# EAGLE schematic peripherial_schematic (EAGLE 9.3.0)
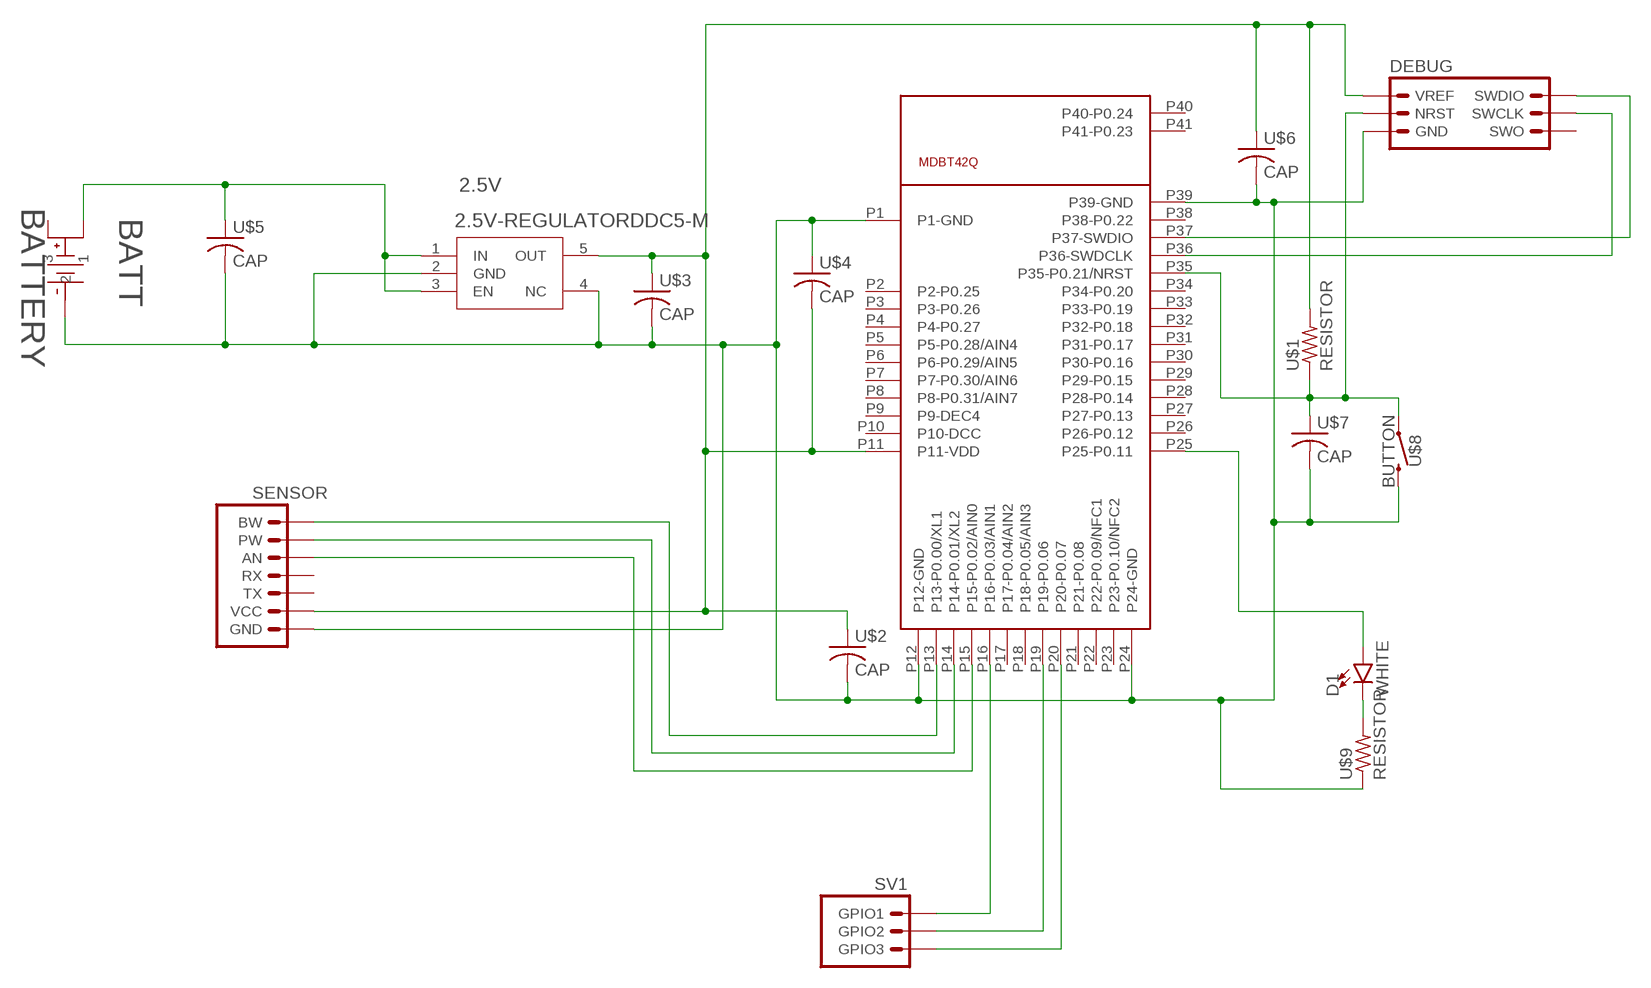
[diagram p0: schematic, sheet 1]

## Parts
2.5V  2.5V-REGULATORDDC5-M  [DDC5-M]
BATT  BATTERY  [BAT_HLDR_2468]
D1  WHITE  LED_12061206  [LED-1206]
DEBUG  DEBUGGER  [MA03-2]
MICRO  MDBT42Q  [MDBT40]
SENSOR  SENSORHEADER  [MA07-1]
SV1  GPIO  [MA03-1]
U$1  RESISTOR  [M1206]
U$2  CAP  [C1206]
U$3  CAP  [C1206]
U$4  CAP  [C1206]
U$5  CAP  [C1206]
U$6  CAP  [C1206]
U$7  CAP  [C1206]
U$8  BUTTON  [TACTILE_SWITCH_SMD_6.2MM_TALL]
U$9  RESISTOR  [M1206]

## Nets
N$1: 2.5V.1(IN) 2.5V.3(EN) BATT.1 U$5.1
N$2: 2.5V.2(GND) 2.5V.4(NC) BATT.2 DEBUG.2(GND) MICRO.P1(P1-GND) MICRO.P12(P12-GND) MICRO.P24(P24-GND) MICRO.P39(P39-GND) SENSOR.1(GND) U$2.2 U$3.2 U$4.1 U$5.2 U$6.2 U$7.2 U$8.TOP1 U$8.TOP2 U$9.1
N$3: MICRO.P15(P15-P0.02/AIN0) SENSOR.5(AN)
N$4: 2.5V.5(OUT) DEBUG.6(VREF) MICRO.P11(P11-VDD) SENSOR.2(VCC) U$1.2 U$2.1 U$3.1 U$4.2 U$6.1
N$5: MICRO.P14(P14-P0.01/XL2) SENSOR.6(PW)
N$6: D1.A MICRO.P25(P25-P0.11)
N$7: DEBUG.4(NRST) MICRO.P35(P35-P0.21/NRST) U$1.1 U$7.1 U$8.BOTTOM1 U$8.BOTTOM2
N$8: D1.C U$9.2
N$9: MICRO.P13(P13-P0.00/XL1) SENSOR.7(BW)
N$10: MICRO.P16(P16-P0.03/AIN1) SV1.3(GPIO1)
N$11: DEBUG.3(SWCLK) MICRO.P36(P36-SWDCLK)
N$12: DEBUG.5(SWDIO) MICRO.P37(P37-SWDIO)
N$13: MICRO.P19(P19-P0.06) SV1.2(GPIO2)
N$14: MICRO.P20(P20-P0.07) SV1.1(GPIO3)
Unconnected: BATT.3 DEBUG.1(SWO) MICRO.P2(P2-P0.25) MICRO.P3(P3-P0.26) MICRO.P4(P4-P0.27) MICRO.P5(P5-P0.28/AIN4) MICRO.P6(P6-P0.29/AIN5) MICRO.P7(P7-P0.30/AIN6) MICRO.P8(P8-P0.31/AIN7) MICRO.P9(P9-DEC4) MICRO.P10(P10-DCC) MICRO.P17(P17-P0.04/AIN2) MICRO.P18(P18-P0.05/AIN3) MICRO.P21(P21-P0.08) MICRO.P22(P22-P0.09/NFC1) MICRO.P23(P23-P0.10/NFC2) MICRO.P26(P26-P0.12) MICRO.P27(P27-P0.13) MICRO.P28(P28-P0.14) MICRO.P29(P29-P0.15) MICRO.P30(P30-P0.16) MICRO.P31(P31-P0.17) MICRO.P32(P32-P0.18) MICRO.P33(P33-P0.19) MICRO.P34(P34-P0.20) MICRO.P38(P38-P0.22) MICRO.P40(P40-P0.24) MICRO.P41(P41-P0.23) SENSOR.3(TX) SENSOR.4(RX)

## Library data of the parts
2.5V = third_eye:2.5V-REGULATOR; MANUFACTURER_PART_NUMBER: TLV70025DDCR; VENDOR: Texas Instruments
BATT = third_eye:BATTERY; MANUFACTURER_PART_NUMBER: 2468; VENDOR: SILICON LABS
D1 = third_eye:LED_1206: White SMD LED Used in manufacturing several products at SparkFun. Packages: 0603 - Bright White SMD 0603 package[Product Link] <http://www.kingbrightusa.com/product.asp?catalog_name=LED&product_id=APT1608QWF/D> 1206 - Bright White SMD1206 package [Product Link] <http://www.kingbrightusa.com/product.asp?catalog_name=LED&product_id=APT3216QWF/D> 3014 - Super Bright SMD 3014 package [Datasheet] <http://www.lumileds.com/uploads/459/DS208-pdf> SparkFun Products: Blackberry Trackballer Breakout <https://www.sparkfun.com/products/13169> Digital SandBox <https://www.sparkfun.com/products/12651>; PROD_ID: DIO-09955
DEBUG = third_eye:DEBUGGER: PIN HEADER; OC_FARNELL: unknown; OC_NEWARK: unknown
MICRO = third_eye:MDBT42Q
SENSOR = third_eye:SENSORHEADER: PIN HEADER; OC_FARNELL: unknown; OC_NEWARK: unknown
SV1 = third_eye:GPIO: PIN HEADER; OC_FARNELL: unknown; OC_NEWARK: unknown
U$1 U$9 = third_eye:RESISTOR
U$2-U$7 = third_eye:CAP
U$8 = third_eye:BUTTON